# Altium schematic sheet Buck 3V3.SchDoc
size A; SheetNumber: 8; SheetTotal: 8
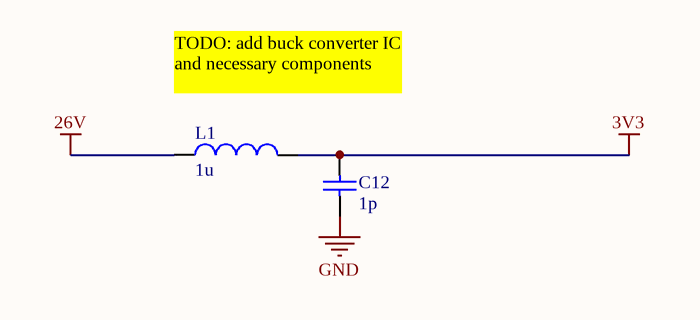
[diagram p0: Buck 3V3.SchDoc]

## Parts
C12  value 1p  (hidden comment: Capacitor)
L1  value 1u  (hidden comment: Inductor)

## Nets
3V3: C12.2 L1.2
26V: L1.1
GND: C12.1

## Notes on the sheet
- TODO: add buck converter IC and necessary components

## Library data of the parts
C12 = Capacitor: SimulationGenericComponent: True
L1 = Inductor: SimulationGenericComponent: True